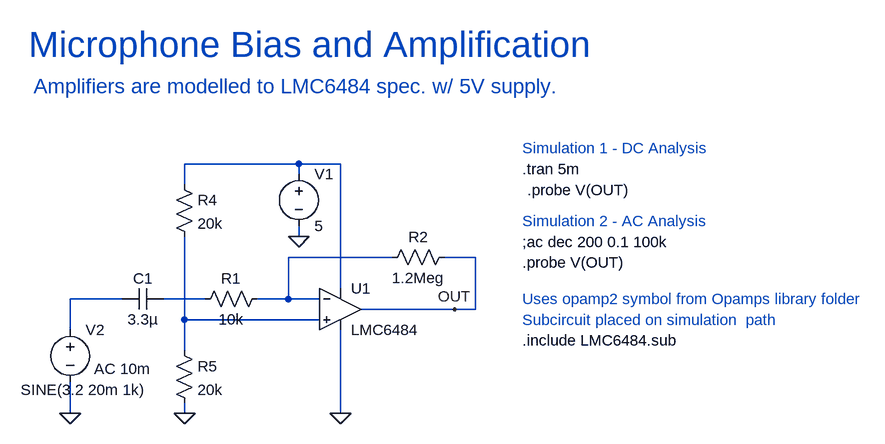
[diagram p0: schematic LMC6484.asc]
LMC6484.asc, the LTspice schematic file:
Version 4
SHEET 1 1216 680
WIRE 16 0 -160 0
WIRE 80 0 16 0
WIRE 16 16 16 0
WIRE -160 32 -160 0
WIRE 16 112 16 96
WIRE 160 144 0 144
WIRE 288 144 240 144
WIRE 80 192 80 0
WIRE -256 208 -336 208
WIRE -128 208 -192 208
WIRE 0 208 0 144
WIRE 0 208 -48 208
WIRE 48 208 0 208
WIRE 256 224 112 224
WIRE 288 224 288 144
WIRE 288 224 256 224
WIRE -160 240 -160 112
WIRE 48 240 -160 240
WIRE -336 256 -336 208
WIRE -160 288 -160 240
WIRE -336 384 -336 336
WIRE -160 384 -160 368
WIRE 80 384 80 256
FLAG 80 384 0
FLAG -336 384 0
FLAG 16 112 0
FLAG 256 224 OUT
FLAG -160 384 0
SYMBOL Opamps\\opamp2 80 160 R0
SYMATTR InstName U1
SYMATTR Value LMC6484
SYMBOL voltage 16 0 R0
SYMATTR InstName V1
SYMATTR Value 5
SYMBOL res -32 192 R90
WINDOW 0 0 56 VBottom 2
WINDOW 3 32 56 VTop 2
SYMATTR InstName R1
SYMATTR Value 10k
SYMBOL res 256 128 R90
WINDOW 0 0 56 VBottom 2
WINDOW 3 32 56 VTop 2
SYMATTR InstName R2
SYMATTR Value 1.2Meg
SYMBOL voltage -336 240 R0
WINDOW 3 -76 108 Left 2
WINDOW 123 37 76 Left 2
WINDOW 39 0 0 Left 2
SYMATTR Value SINE(3.2 20m 1k)
SYMATTR Value2 AC 10m
SYMATTR InstName V2
SYMBOL cap -192 192 R90
WINDOW 0 0 32 VBottom 2
WINDOW 3 32 32 VTop 2
SYMATTR InstName C1
SYMATTR Value 3.3µ
SYMBOL res -176 16 R0
SYMATTR InstName R4
SYMATTR Value 20k
SYMBOL res -176 272 R0
SYMATTR InstName R5
SYMATTR Value 20k
TEXT 360 272 Left 2 !.include LMC6484.sub
TEXT 360 8 Left 2 !.tran 5m
TEXT 360 208 Left 2 ;Uses opamp2 symbol from Opamps library folder
TEXT 360 120 Left 2 !;ac dec 200 0.1 100k
TEXT -400 -184 Left 5 ;Microphone Bias and Amplification
TEXT -392 -120 Left 3 ;Amplifiers are modelled to LMC6484 spec. w/ 5V supply.
TEXT 360 -24 Left 2 ;Simulation 1 - DC Analysis
TEXT 360 88 Left 2 ;Simulation 2 - AC Analysis
TEXT 360 240 Left 2 ;Subcircuit placed on simulation  path
TEXT 360 152 Left 2 !.probe V(OUT)
TEXT 368 40 Left 2 !.probe V(OUT)

The netlist it stands for:
* LMC6484.asc
XU1 N005 N002 N001 0 OUT LMC6484  ; pins In+ In- V+ V- OUT
V1 N001 0 5
R1 N002 N004 10k
R2 OUT N002 1.2Meg
V2 N003 0 SINE(3.2 20m 1k) AC 10m
C1 N004 N003 3.3µ
R4 N001 N005 20k
R5 N005 0 20k
.include LMC6484.sub
.tran 5m
* Uses opamp2 symbol from Opamps library folder
;ac dec 200 0.1 100k
* Microphone Bias and Amplification
* Amplifiers are modelled to LMC6484 spec. w/ 5V supply.
* Simulation 1 - DC Analysis
* Simulation 2 - AC Analysis
* Subcircuit placed on simulation  path
.probe V(OUT)
.probe V(OUT)
.backanno
.end